# Altium schematic sheet MCU.SchDoc
size A4
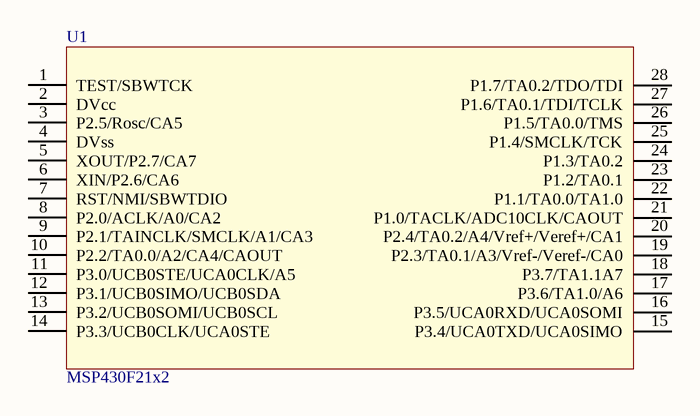
[diagram p0: MCU.SchDoc]

## Parts
U1  MSP430F21x2  [TSSOP28]

## Nets

Not connected (* = marked no-connect by the designer): U1 1(TEST/SBWTCK) 2(DVcc) 3(P2.5/Rosc/CA5) 4(DVss) 5(XOUT/P2.7/CA7) 6(XIN/P2.6/CA6) 7(RST/NMI/SBWTDIO) 8(P2.0/ACLK/A0/CA2) 9(P2.1/TAINCLK/SMCLK/A1/CA3) 10(P2.2/TA0.0/A2/CA4/CAOUT) 11(P3.0/UCB0STE/UCA0CLK/A5) 12(P3.1/UCB0SIMO/UCB0SDA) 13(P3.2/UCB0SOMI/UCB0SCL) 14(P3.3/UCB0CLK/UCA0STE) 15(P3.4/UCA0TXD/UCA0SIMO) 16(P3.5/UCA0RXD/UCA0SOMI) 17(P3.6/TA1.0/A6) 18(P3.7/TA1.1A7) 19(P2.3/TA0.1/A3/Vref-/Veref-/CA0) 20(P2.4/TA0.2/A4/Vref+/Veref+/CA1) 21(P1.0/TACLK/ADC10CLK/CAOUT) 22(P1.1/TA0.0/TA1.0) 23(P1.2/TA0.1) 24(P1.3/TA0.2) 25(P1.4/SMCLK/TCK) 26(P1.5/TA0.0/TMS) 27(P1.6/TA0.1/TDI/TCLK) 28(P1.7/TA0.2/TDO/TDI)

## Library data of the parts
U1 = MSP430F21x2_PW